# Altium schematic sheet power.SchDoc
size A; SheetNumber: 3; SheetTotal: 4
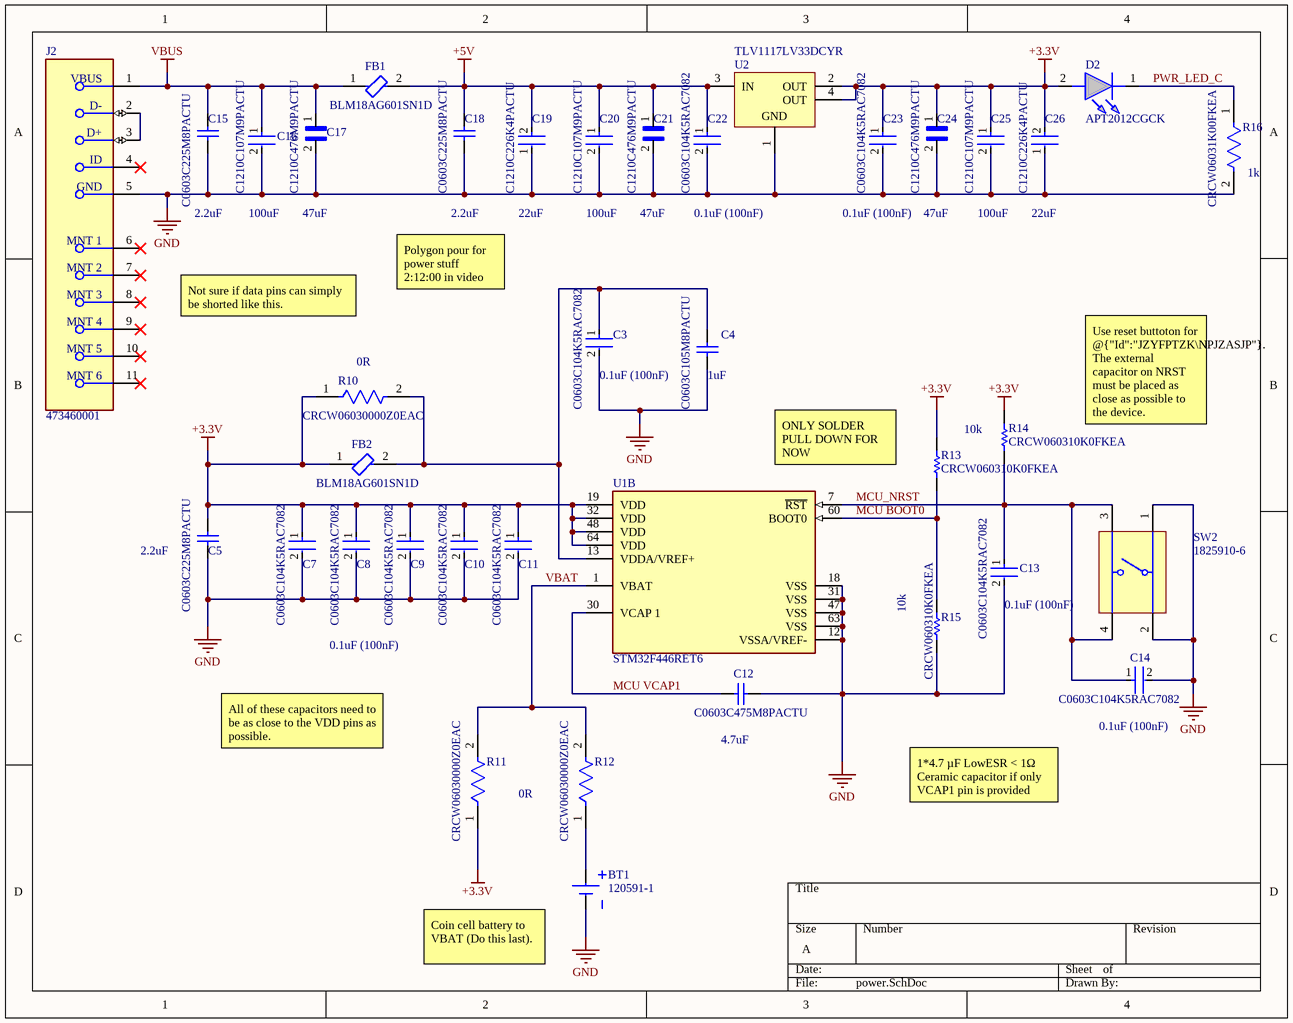
[diagram p0: power.SchDoc]

## Parts
BT1  120591-1  [TECO-120591-1-2_V]
C3  C0603C104K5RAC7082  [FP-C0603C-CF-MFG]
C4  C0603C105M8PACTU  [CAPC1608X90X35LL15T15]
C5  C0603C225M8PACTU  [CAPC1608X90X35LL15T15]
C7  C0603C104K5RAC7082  [FP-C0603C-CF-MFG]
C8  C0603C104K5RAC7082  [FP-C0603C-CF-MFG]
C9  C0603C104K5RAC7082  [FP-C0603C-CF-MFG]
C10  C0603C104K5RAC7082  [FP-C0603C-CF-MFG]
C11  C0603C104K5RAC7082  [FP-C0603C-CF-MFG]
C12  C0603C475M8PACTU  [CAPC1608X90X35ML15T15]
C13  C0603C104K5RAC7082  [FP-C0603C-CF-MFG]
C14  C0603C104K5RAC7082  [FP-C0603C-CF-MFG]
C15  C0603C225M8PACTU  [CAPC1608X90X35LL15T15]
C16  C1210C107M9PACTU  [FP-C1210C107M9PACTU-MFG]
C17  C1210C476M9PACTU  [CAPC3225X280]
C18  C0603C225M8PACTU  [CAPC1608X90X35LL15T15]
C19  C1210C226K4PACTU  [FP-C1210C226K4PACTU-MFG]
C20  C1210C107M9PACTU  [FP-C1210C107M9PACTU-MFG]
C21  C1210C476M9PACTU  [CAPC3225X280]
C22  C0603C104K5RAC7082  [FP-C0603C-CF-MFG]
C23  C0603C104K5RAC7082  [FP-C0603C-CF-MFG]
C24  C1210C476M9PACTU  [CAPC3225X280]
C25  C1210C107M9PACTU  [FP-C1210C107M9PACTU-MFG]
C26  C1210C226K4PACTU  [FP-C1210C226K4PACTU-MFG]
D2  APT2012CGCK  [LEDC2012X50N]
FB1  BLM18AG601SN1D  [FP-BLM18-0_15-t0_8-MFG]
FB2  BLM18AG601SN1D  [FP-BLM18-0_15-t0_8-MFG]
J2  473460001  [FP-473460001-MFG]
R10  CRCW06030000Z0EAC  [FP-CRCW0603-C-IPC_B]
R11  CRCW06030000Z0EAC  [FP-CRCW0603-C-IPC_B]
R12  CRCW06030000Z0EAC  [FP-CRCW0603-C-IPC_B]
R13  CRCW060310K0FKEA  [RESC1609X50X30NL8T20]
R14  CRCW060310K0FKEA  [RESC1609X50X30NL8T20]
R15  CRCW060310K0FKEA  [RESC1609X50X30NL8T20]
R16  CRCW06031K00FKEA  [FP-CRCW0603-e3-MFG]
SW2  1825910-6  [TECO-1825910-6_V]
U1  STM32F446RET6  [FP-LQFP64-5W-MFG]  (part B of 2)
U2  TLV1117LV33DCYR  [DCY0004A_N]

## Nets
+3.3V: C5.1 C7.1 C8.1 C9.1 C10.1 C11.1 C23.1 C24.1 C25.1 C26.2 D2.2(A) FB2.1 R10.1 R11.1 R13.2 R14.2 U1.19(VDD) U1.32(VDD) U1.48(VDD) U1.64(VDD) U2.2(OUT) U2.4(OUT)
+5V: C18.1 C19.2 C20.1 C21.1 C22.1 FB1.2 U2.3(IN)
GND: BT1.2(-) C3.2 C4.1 C5.2 C7.2 C8.2 C9.2 C10.2 C11.2 C12.2 C13.2 C14.2 C15.2 C16.2 C17.2 C18.2 C19.1 C20.2 C21.2 C22.2 C23.2 C24.2 C25.2 C26.1 J2.5(GND) R15.1 R16.2 SW2.1 SW2.2 U1.12(VSSA/VREF-) U1.18(VSS) U1.31(VSS) U1.47(VSS) U1.63(VSS) U2.1(GND)
VBUS: C15.1 C16.1 C17.1 FB1.1 J2.1(VBUS)
MCU BOOT0: R13.1 R15.2 U1.60(BOOT0)
MCU VCAP1: C12.1 U1.30(VCAP_1)
MCU_NRST: C13.1 C14.1 R14.1 SW2.3 SW2.4 U1.7(~{RST})
PWR_LED_C: D2.1(K) R16.1
VBAT: R11.2 R12.2 U1.1(VBAT)
NetBT1_1: BT1.1(+) R12.1
NetC3_1: C3.1 C4.2 FB2.2 R10.2 U1.13(VDDA/VREF+)
NetJ2_2: J2.2(D-) J2.3(D+)

Not connected (* = marked no-connect by the designer): J2 4(ID)* 6(MNT_1)* 7(MNT_2)* 8(MNT_3)* 9(MNT_4)* 10(MNT_5)* 11(MNT_6)*

## Notes on the sheet
- 2.2uF
- 100uF
- 47uF
- 22uF
- 0.1uF (100nF)
- (near R16) 1k
- Polygon pour for power stuff 2:12:00 in video
- Not sure if data pins can simply be shorted like this.
- (near R10) 0R
- (near C4) 1uF
- 10k
- Use reset buttoton for @{"Id":"JZYFPTZK\NPJZASJP"}.
  The external capacitor on NRST must be placed as close as possible to the device.
- ONLY SOLDER PULL DOWN FOR NOW
- (near C5) 2.2uF
- (near R15) 10k
- All of these capacitors need to be as close to the VDD pins as possible.
- (near C12) 4.7uF
- (near C14) 0.1uF (100nF)
- 0R
- 1*4.7 µF LowESR < 1Ω Ceramic capacitor if only VCAP1 pin is provided
- (near BT1) Coin cell battery to VBAT (Do this last).

## Library data of the parts
BT1 = CMP-0438-00001-2: Lithium Battery Holder for CR2032 3V Cell; Manufacturer: TE Connectivity; Packing Type: Tray; Body Shape: Horizontal Cylindrical; AccessRights: 2147483647; RevisionId: 1; Folder: Unified Components\Components\TE Connectivity\Connectors & Connector Components\Power Products\Battery Interconnection Products\; ContentType: Unified Component; ContentTypeGUID: CB3C11C4-E317-11DF-B822-12313F0024A2; ComponentLink1Description: Manufacturer URL; LifeCycleStateGUID: 61E382EE-6656-4F12-9E24-BE9327104A25; FolderGUID: A6761B51-D489-48A3-9180-F4808F45AB79; PartNumber: 120591-1; LifeCycle: Released; ReleaseDate: 20/08/2013 02:50:22 AM; PackageReference: 120591-1; ComponentLink2URL: http://www.te.com/commerce/DocumentDelivery/DDEController?Action=showdoc&DocId=Customer+Drawing%7F120591%7FH%7Fpdf%7FEnglish%7FENG_CD_120591_H.pdf%7F120591-1; DatasheetVersion: Rev. H, 01/2013; PackageDescription: Lithium Battery Holder; ItemGUID: B2C50140-681E-4F62-8DBB-9728605318CE; ItemHRID: CMP-0438-00001; Mounting Technology: Through Hole; ComponentLink1URL: http://www.te.com/; ComponentLink2Description: Datasheet
C3 C7-C11 C13 C14 C22 C23 = CMP-03020-002411-2: C0603 0.10 μF X7R 30ppm/°C 10.00% 50 V; Manufacturer: KEMET; Voltage Rating: 50 V; Capacitance: 0.10 μF; Automotive Grade: Grade 1; Material: Ceramic; Value: 0.10 μF; Tolerance: 0.1; Automotive: Yes; Temperature Range Low: -55°C; Octopart: https://octopart.com/c0603c104k5rac7082-kemet-75146597; Temperature Coefficient: 30ppm/°C; ComponentLink2URL: https://api.kemet.com/component-edge/download/datasheet/C0603C100J5GACAUTO.pdf; RoHS: TRUE; ComponentLink2Description: Datasheet; Manufacturer Part Number: C0603C104K5RAC7082; Height: 0.87mm; Device Class L3: Ceramic Capacitors; Package: C0603C-CF; Temperature Characteristic: X7R; Device Class L2: Capacitors; Lead Free: Yes; Device Class L1: Passive Components; Temperature: -55°C to +125°C; Temperature Range High: +125°C; Category: Cap
C4 = CMP-2006-02271-1: Manufacturer: Kemet; Part Number: C0603C105M8PACTU
C5 C15 C18 = CMP-2006-02273-1: Manufacturer: Kemet; Part Number: C0603C225M8PACTU
C12 = CMP-2006-02263-1: Manufacturer: Kemet; Part Number: C0603C475M8PACTU
C16 C20 C25 = CMP-2000-06018-2: CAP CER 100UF 6.3V X5R 1210; Dissipation Factor: 5%; Dielectric Material: Ceramic; Tolerance: 20%; Termination: SMD/SMT; REACH SVHC: No SVHC; Thickness: 0.11inch; Packaging: Tape and Reel; Series: C; Width: 2.5mm; Voltage Rating (DC): 6.3V; Voltage: 6.3V; Contact Plating: Tin; Package Quantity: 1; Case/Package: 1210; Min Operating Temperature: -55°C; Height: 2.5mm; Radiation Hardening: No; Capacitance: 100uF; Case Code (Metric): 3225; Depth: 2.5mm; Construction: Flat; Max Operating Temperature: 85°C; Number of Pins: 2; Mount: Surface Mount; Lead Free: Lead Free; RoHS Compliant: Yes; Voltage Rating: 6.3V; Dielectric: X5R; Length: 3.2mm; Case Code (Imperial): 1210
C17 C21 C24 = C1210C476M9PACTU: CAP, MLCC, X5R, 47UF, 6.3V, 1210; Package: None; Price: None; Value: *; MP: C1210C476M9PACTU; Availability: Unavailable
C19 C26 = CMP-03020-034645-1: CAP CER 22UF 16V X5R 1210; Tolerance: 10%; Dielectric Material: Ceramic; Case Code (Metric): 3225; Mount: Surface Mount; Voltage: 16V; Construction: Flat; Lead Free: Lead Free; Radiation Hardening: No; Case Code (Imperial): 1210; Min Operating Temperature: -55°C; Height: 1.85mm; Termination: SMD/SMT; Voltage Rating (DC): 16V; Length: 3.2mm; Voltage Rating: 16V; Max Operating Temperature: 85°C; Packaging: Tape and Reel; RoHS Compliant: Yes; Capacitance: 22uF; Depth: 2.5mm; Case/Package: 1210; Dielectric: X5R
D2 = APT2012CGCK: Kingbright APT2012CGCK, APT2012 Series Green LED, 570 nm, 2012 (0805) Clear, Rectangle Lens SMD Package; Geometry.Height: 0.5mm; Mouser Part Number: 604-APT2012CGCK; Mouser Price/Stock: https://www.mouser.co.uk/ProductDetail/Kingbright/APT2012CGCK?qs=VdjlWU%2FzoOEv1TxC2gMNzg%3D%3D; Manufacturer_Name: Kingbright; Manufacturer_Part_Number: APT2012CGCK; Datasheet Link: https://componentsearchengine.com/Datasheets/1/APT2012CGCK.pdf
FB1 FB2 = CMP-0686-00436-3: Chip Ferrite Bead, 0603, 600Ω @ 100MHz, 0.38Ω, 25%, 500mA; Number of Lines: 1; Impedance: 600R; DC Resistance (DCR): 380mR; Material: Steel; Shielding: Unshielded; Max DC Current: 500mA; Termination: SMD/SMT; Military Standard: Not; Number of Circuits: 1; Min Operating Temperature: -55°C; Case Code (Imperial): 0603; Width: 0.8mm; Current Rating: 500mA; Lead Free: Lead Free; Packaging: Tape and Reel; Frequency: 100MHz; Max Operating Temperature: 125°C; DC Current: 500mA; REACH SVHC: No SVHC; Case/Package: 0603; Package Quantity: 1; Height: 0.8mm; Number of Pins: 2; Depth: 0.8mm; Test Frequency: 100MHz; Case Code (Metric): 1608; Tolerance: 25%; Core Material: Ferrite; Weight: 7.1E-05oz; Max Current Rating: 500mA; Radiation Hardening: No; Length: 1.6mm; RoHS Compliant: Yes
J2 = CMP-2000-05246-2: CONN RCPT USB2.0 MICRO B SMD R/A; Manufacturer: Molex; Conn Orientation: Right Angle; Is Female: yes; Shielding: true; Pitch: 0.65mm; Number Of Contacts: 5; Voltage Rating: 30V; Current Rating: 1.8A; Device Class L2: USB Connectors; Digikey Description: CONN RCPT USB2.0 MICRO B SMD R/A; Height: 2.945mm; RoHS: TRUE; ComponentLink2Description: Datasheet; Octopart: https://octopart.com/47346-0001-molex-7164928; Automotive: No; Package: 0; Category: Conn; Device Class L1: Connectors; Usb Standard: USB 2.0; Temperature: -30°C to +85°C; Temperature Range Low: -30°C; Footprint Url: https://www.molex.com/pdm_docs/sd/473460001_sd.pdf; ComponentLink2URL: https://www.molex.com/webdocs/datasheets/pdf/en-us/0473460001_IO_CONNECTORS.pdf; Lead Free: Yes; Manufacturer Part Number: 473460001; Contact Material: Gold,Nickel; Temperature Range High: +85°C; Device Class L3: unset
R10-R12 = CMP-02407-012292-2: RES 0 OHM JUMPER 1/10W 0603; Resistance: 22R; Power Rating: 100mW; Case/Package: Molded; Contact Plating: Tin; Resistor Type: Thick Film; Min Operating Temperature: -55°C; Termination: Wraparound; Max Operating Temperature: 155°C; Lead Free: Lead Free; Length: 1.55mm; RoHS Compliant: Yes; Mount: Surface Mount
R13-R15 = CMP-1666-00005-4: Chip Resistor, 10 KOhm, +/- 1%, 100 mW, -55 to 155 degC, 0603 (1608 Metric), RoHS, Tape and Reel; Manufacturer: Vishay Semiconductor; Voltage Rating: 75 V; Max Operating Temperature: 155 degC; PackageDescription: 2-Pin Surface Mount Device, Body 1.575 x 0.85 mm; ComponentLink1Description: Manufacturer URL; RoHSCompliant: true; PackageReference: 0603; REACH SVHC: Unknown; Length: 1.55 mm; DatasheetVersion: 06/2012; Packaging: Tape and Reel; Min Operating Temperature: -55 degC; Mounting Technology: Surface Mount; ComponentLink2URL: https://datasheet.ciiva.com/11809/0900766b80d98afc-11809037.pdf; Height: 0.45 mm; ComponentLink2Description: Datasheet; Package Quantity: 5000; ComponentLink1URL: http://www.vishay.com/
R16 = CMP-1666-00003-5: RES Thick Film, 1kΩ, 1%, 0.1W, 100ppm/°C, 0603; Max Power Dissipation: 100mW; Voltage Rating: 75V; Resistance: 1kR; Max Operating Temperature: 155°C; Number of Pins: 2; Case Code (Imperial): 0603; Width: 0.033inch; Power Rating: 100mW; Number of Terminations: 2; Package Quantity: 10; Weight: 7.1E-05oz; Tolerance: 1%; Temperature Coefficient: 100ppm/°C; Military Standard: Not; Mount: Surface Mount; Voltage Rating (DC): 75V; Depth: 0.85mm; Composition: Thick Film; Radiation Hardening: No; Termination: SMD/SMT; Length: 1.55mm; Case Code (Metric): 1608; Contact Plating: Tin; Min Operating Temperature: -55°C; Packaging: Tape and Reel; Height: 0.45mm; Lead Free: Lead Free; Case/Package: 0603; Features: Automotive AEC-Q200
SW2 = CMP-1684-00021-1: Tact Switch, SPST-NO, 0.05 A, -35 to 85 degC, 4-Pin THD, RoHS, Bulk; Manufacturer: TE Connectivity; Maximum Contact Resistance: 100mOhm; Mechanical Life: 100000Cycles; Bushing Type: Unthreaded; Switch Configuration: OFF(ON); Maximum DC Voltage Rating: 24V; Contact Rating @ Voltage: 0.05A@24VDC; Actuator Color: Black; Body Orientation: Straight; Function: MomentaryContact; Illumination: N/R; Actuator Style: RoundButton; Actuator Material: PolybutyleneTerephthalate; Dielectric Strength: 500VAC; Pole Throw Configuration: SPST; Actuator Length: 1.4mm; Product Weight: N/A; Contact Material: CopperAlloy; Housing Material: N/A; Terminal Type: PCPins; Minimum Insulation Resistance: 100MOhm; Package Description: 4-Pin Through Hole Device, Body 5.99 x 5.99 mm, Pitch 6.5 mm; Part No: 1825910-6; Package Reference: THD; Base Material: N/A; Manufacturer URL: http://www.te.com; Contact Plating: Silver; RoHS: Yes; Datasheet Version: Rev. C9; Electrical Life: 100000Cycles; Maximum AC Voltage Rating: N/A; Thread Size: N/R; Operating Temperature: -35to85C; Mounting: ThroughHole; Dimension: 5.99x5mm; Datasheet URL: http://www.te.com/commerce/DocumentDelivery/DDEController?Action=showdoc&DocId=Customer+Drawing%7F1825910%7FC9%7Fpdf%7FEnglish%7FENG_CD_1825910_C9.pdf%7F1825910-6; Family: 1825910; Seal Location: N/A; Seal Description: N/A; Packaging: N/A
U1 = CMP-12105-000007-1: IC MCU 32BIT 512KB FLASH 64LQFP; Manufacturer: ST; Number Of Spi Channels: 4; Ram Size: 128KBytes; Standoff Height: 0.05mm; Number Of Uart Channels: 6; Number Of Pwm Channels: 32; Max Junction Temp: +105°C; Number Of I/Os: 50; Number Of Usb Channels: 2; Frequency: 180MHz; Number Of A/D Converters: 3; Max Supply Voltage: 3.6V; Number Of Adc Channels: 16; Interface: I2C,SPI,UART,USART,CAN,USB,LIN,IrDA,I2S,Other; Memory Size: 512KBytes; Number Of Timers/Counters: 14; Min Supply Voltage: 1.7V; Core Architecture: ARM Cortex-M4; Data Bus Width: 32bits; Number Of Cores: 1; Ambient Temperature Range Low: -40°C; ComponentLink2URL: https://www.st.com/en/microcontrollers-microprocessors/stm32f446re.html; Category: IC; Height: 1.6mm; Ipc Land Pattern Name: QFP50P1200X1200X160-64; Manufacturer Part Number: STM32F446RET6; Octopart: https://octopart.com/stm32f446ret6-stmicroelectronics-52642920; Temperature Range High: +105°C; Lead Free: Yes; Mouser Description: ARM Microcontrollers - MCU High-performance and DSP with FP, ARM Cortex-M4 MCU with 512 Kbytes Flash, 180 MHz CPU, Art Accelerator, SDRAM; Digikey Description: IC MCU 32BIT 512KB FLASH 64LQFP; Ambient Temperature Range High: +85°C; Number Of I2C Channels: 4; Memory Type: FLASH; RoHS: TRUE; Automotive: No; Device Class L1: Integrated Circuits (ICs); Temperature: -40°C to +105°C; Device Class L2: Embedded Processors and Controllers; Device Class L3: Microcontrollers; Temperature Range Low: -40°C; Package: LQFP64-5W; ComponentLink2Description: Datasheet
U2 = CMP-0395-00503-2: Single Output LDO, 1 A, Fixed 3.3 V Output, 2 to 5.5 V Input, 4-pin SOT-223 (DCY), -40 to 125 degC, Green (RoHS & no Sb/Br); Manufacturer: Texas Instruments; Vout Adj(Min)(V): 3.3; Vdo(Typ)(mV): 1200; Iq(Typ)(mA): 0.05; Accuracy(%): 2; Iout(Max)(A): 1; SubFamily: Single Channel LDO; Vin(Max)(V): 5.5; PackageReference: DCY0004A; PackageDescription: 4-Pin Plastic Small Outline, Body 3.5 x 6.5 mm, Pitch 2.3 mm; Vout Adj(Max)(V): 3.3; Mounting Technology: Surface Mount; ComponentLink2Description: Datasheet; ComponentLink1Description: Manufacturer URL; PartNumber: TLV1117LV33DCYR; ComponentLink3Description: Package Specification; ComponentLink1URL: http://www.ti.com/; ComponentLink2URL: http://www.ti.com/general/docs/lit/getliterature.tsp?genericPartNumber=TLV1117LV33&fileType=pdf; Fixed Output Options(V): 3.3; PackageVersion: 4202506/B; Vin(Min)(V): 2; DatasheetVersion: SBVS160A; Eco-Plan: Green (RoHS & no Sb/Br); ComponentLink3URL: http://www.ti.com/litv/pdf/mpds094a; Code_JEDEC: TO-261